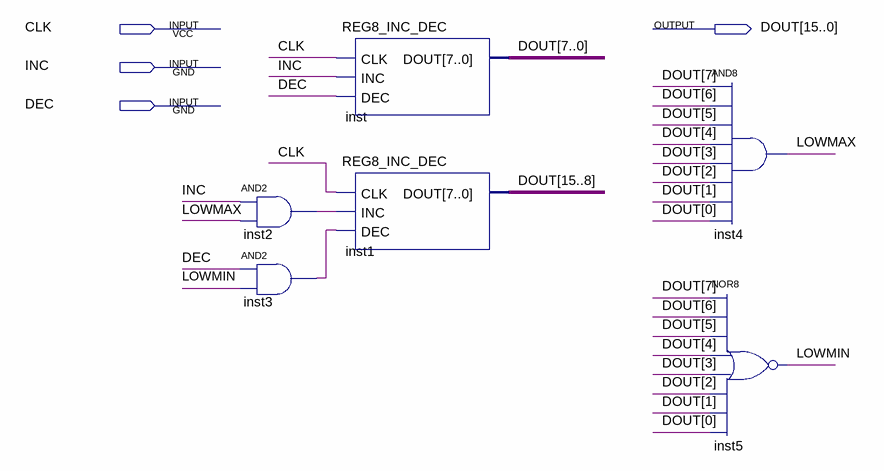
[diagram p0: schematic sheet]
// Quartus schematic REG16_INC_DEC.bdf as structural Verilog: 6 symbols, 4 pins
module REG16_INC_DEC (
  input  CLK,
  input  INC,
  input  DEC,
  output [15:0] DOUT
);

  wire inst2_out, inst3_out, LOWMAX, LOWMIN;

  and inst2 (inst2_out, INC, LOWMAX);
  and inst3 (inst3_out, DEC, LOWMIN);
  REG8_INC_DEC inst (.CLK(CLK), .INC(INC), .DEC(DEC), .DOUT(DOUT[7:0]));
  REG8_INC_DEC inst1 (.CLK(CLK), .INC(inst2_out), .DEC(inst3_out), .DOUT(DOUT[15:8]));
  and inst4 (LOWMAX, DOUT[7], DOUT[6], DOUT[5], DOUT[4], DOUT[3], DOUT[2], DOUT[1], DOUT[0]);
  nor inst5 (LOWMIN, DOUT[7], DOUT[6], DOUT[5], DOUT[4], DOUT[3], DOUT[2], DOUT[1], DOUT[0]);
endmodule
